# EAGLE design Dual Motor Module (EAGLE 6.3)
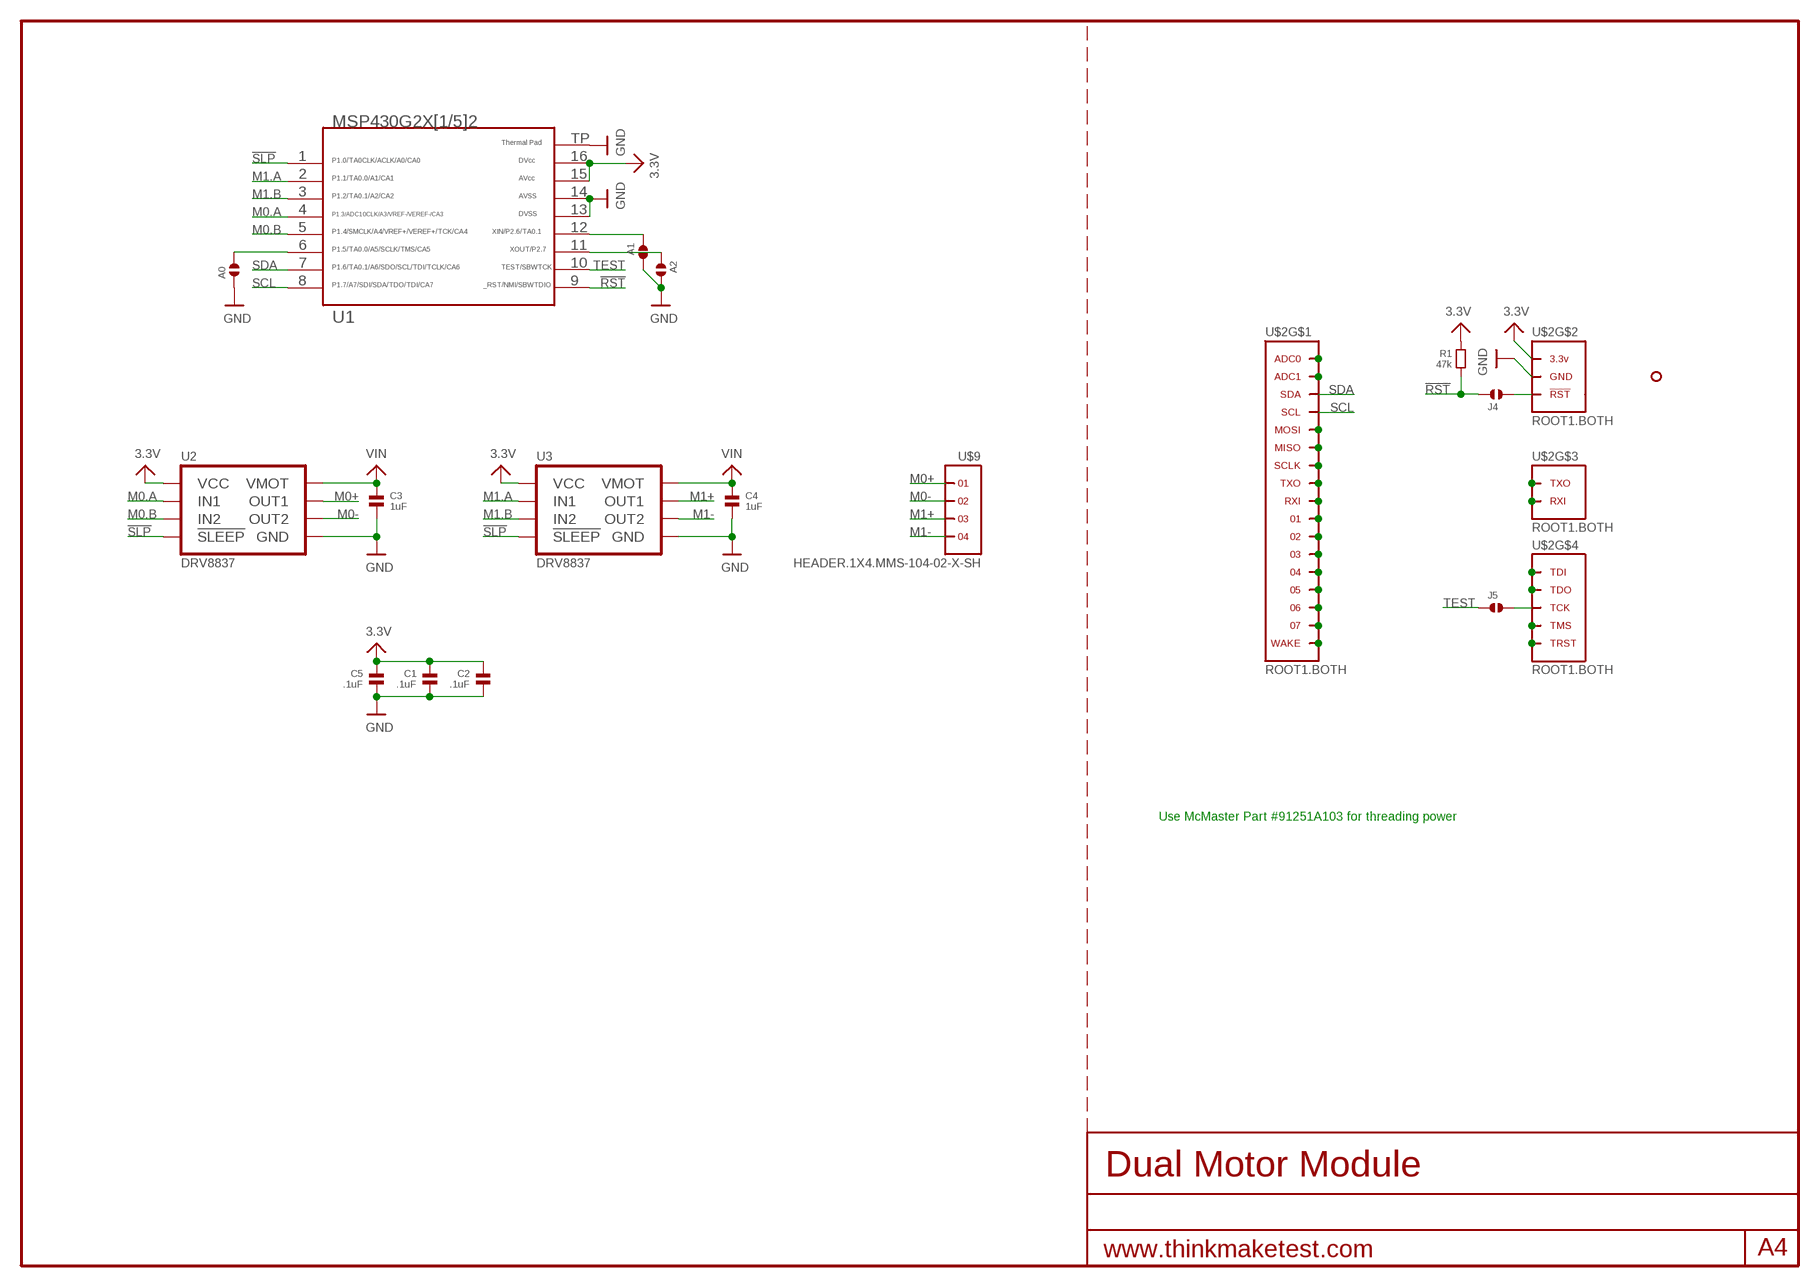
[diagram p0: schematic, sheet 1]

## Parts
A0  SOLDERJUMPER.2.MED  [2.MED]
A1  SOLDERJUMPER.2.MED  [2.MED]
A2  SOLDERJUMPER.2.MED  [2.MED]
C1  .1uF  CAPACITOR.0603  [0603]
C2  .1uF  CAPACITOR.0603  [0603]
C3  1uF  CAPACITOR.0603  [0603]
C4  1uF  CAPACITOR.0603  [0603]
C5  .1uF  CAPACITOR.0603  [0603]
J4  SOLDERJUMPER.2.MED  [2.MED]
J5  SOLDERJUMPER.2.MED  [2.MED]
R1  47k  RESISTOR.0603  [0603]
U1  MSP430G2452.QFN16  G2X[1/5]2---RSA16  [RSA16]
U2  DRV8837  [DSG]
U3  DRV8837  [DSG]
U$2  ROOT1.BOTH  [ROOT1.BOTH]
U$4  HOLE.#2  [#2]
U$9  HEADER.1X4.MMS-104-02-X-SH  [MMS-104-02-X-SH]

## Nets
3.3V: C1.1 C2.1 C5.1 R1.1 U1.15 U1.16 U2.8(VCC) U3.8(VCC) U$2.3.3V@1(3.3V) U$2.3.3V@2(3.3V) U$2.3.3V@3(3.3V) U$2.3.3V@4(3.3V) U$2.3.3V@5(3.3V) U$2.3.3V@6(3.3V) U$2.3.3V@7(3.3V) U$2.3.3V@8(3.3V) U$2.3.3V@9(3.3V) U$2.3.3V@10(3.3V) U$2.3.3V@11(3.3V) U$2.3.3V@12(3.3V) U$2.3.3V@13(3.3V) U$2.3.3V@14(3.3V) U$2.3.3V@15(3.3V) U$2.3.3V@16(3.3V) U$2.3.3V@17(3.3V) U$2.3.3V@18(3.3V) U$2.3.3V@19(3.3V) U$2.3.3V@20(3.3V) U$2.3.3V@21(3.3V) U$2.3.3V@22(3.3V) U$2.3.3V@23(3.3V) U$2.3.3V@24(3.3V) U$2.3.3V@VIA(3.3V)
!RST: J4.1 R1.2 U1.9
!SLP: U1.1 U2.7(!SLEEP) U3.7(!SLEEP)
GND: A0.1 A1.2 A2.2 C1.2 C2.2 C3.2 C4.2 C5.2 U1.13 U1.14 U1.TP U2.4(GND) U2.PAD(GND) U3.4(GND) U3.PAD(GND) U$2.GND@1(GND) U$2.GND@2(GND) U$2.GND@3(GND) U$2.GND@4(GND) U$2.GND@5(GND) U$2.GND@6(GND) U$2.GND@7(GND) U$2.GND@8(GND) U$2.GND@9(GND) U$2.GND@10(GND) U$2.GND@11(GND) U$2.GND@12(GND) U$2.GND@13(GND) U$2.GND@14(GND) U$2.GND@15(GND) U$2.GND@16(GND) U$2.GND@17(GND) U$2.GND@18(GND) U$2.GND@19(GND) U$2.GND@20(GND) U$2.GND@21(GND) U$2.GND@22(GND) U$2.GND@23(GND) U$2.GND@24(GND) U$2.GND@25(GND) U$2.GND@26(GND) U$2.GND@VIA(GND)
M0+: U2.2(OUT1) U$9.1 U$9.1@1
M0-: U2.3(OUT2) U$9.2 U$9.2@1
M0.A: U1.4 U2.6(IN1)
M0.B: U1.5 U2.5(IN2)
M1+: U3.2(OUT1) U$9.3 U$9.3@1
M1-: U3.3(OUT2) U$9.4 U$9.4@1
M1.A: U1.2 U3.6(IN1)
M1.B: U1.3 U3.5(IN2)
N$1: U$2.04 U$2.04@1 U$2.04@VIA
N$2: U$2.ADC1 U$2.ADC1@1(ADC1) U$2.ADC1@VIA(ADC1)
N$3: A0.2 U1.6
N$4: A2.1 U1.11
N$5: U$2.03 U$2.03@1 U$2.03@VIA
N$6: U$2.MISO U$2.MISO@1(MISO) U$2.MISO@VIA(MISO)
N$7: U$2.SCLK U$2.SCLK@1(SCLK) U$2.SCLK@VIA(SCLK)
N$8: U$2.TXO U$2.TXO@1(TXO) U$2.TXO@VIA(TXO)
N$9: U$2.RXI U$2.RXI@1(RXI) U$2.RXI@VIA(RXI)
N$10: U$2.01 U$2.01@1 U$2.01@VIA
N$11: U$2.02 U$2.02@1 U$2.02@VIA
N$12: U$2.MOSI U$2.MOSI@1(MOSI) U$2.MOSI@VIA(MOSI)
N$13: U$2.ADC0 U$2.ADC0@1(ADC0) U$2.ADC0@VIA(ADC0)
N$14: U$2.05 U$2.05@1 U$2.05@VIA
N$15: U$2.06 U$2.06@1 U$2.06@VIA
N$16: U$2.07 U$2.07@1 U$2.07@VIA
N$17: U$2.WAKE U$2.WAKE@1(WAKE) U$2.WAKE@VIA(WAKE)
N$18: U$2.TDI U$2.TDI@1(TDI) U$2.TDI@VIA(TDI)
N$19: U$2.TDO U$2.TDO@1(TDO) U$2.TDO@VIA(TDO)
N$20: J5.2 U$2.TCK U$2.TCK@1(TCK) U$2.TCK@VIA(TCK)
N$21: U$2.TMS U$2.TMS@1(TMS) U$2.TMS@VIA(TMS)
N$22: U$2.TRST U$2.TRST@1(TRST) U$2.TRST@VIA(TRST)
N$23: U$2.RXI.DBG(RXI) U$2.RXI.DBG@1(RXI) U$2.RXI.DBG@VIA(RXI)
N$24: U$2.TXO.DBG(TXO) U$2.TXO.DBG@1(TXO) U$2.TXO.DBG@VIA(TXO)
N$25: J4.2 U$2.RST(!RST) U$2.RST@1(!RST) U$2.RST@VIA(!RST)
N$26: A1.1 U1.12
SCL: U1.8 U$2.SCL U$2.SCL@1(SCL) U$2.SCL@VIA(SCL)
SDA: U1.7 U$2.SDA U$2.SDA@1(SDA) U$2.SDA@VIA(SDA)
TEST: J5.1 U1.10
VIN: C3.1 C4.1 U2.1(VMOT) U3.1(VMOT)

## Notes on the sheet
- Use McMaster Part #91251A103 for threading power

## Library data of the parts
A0 A1 A2 J4 J5 = .solderjumper:SOLDERJUMPER.2
C1-C5 = .standardparts:CAPACITOR
R1 = .standardparts:RESISTOR
U1 = TI_MSP430_v16:G2X[1/5]2---RSA16: MSP430G2X[1/5]2 MSP430G2x52, MSP430G2x12 QFN (RSA) 16 Pin Package http://focus.ti.com/docs/prod/folders/print/msp430g2452.html
U2 U3 = .packages(ti):DRV8837
U$2 = thinkmaketest:ROOT1
U$4 = .screw_holes:HOLE
U$9 = samtec:HEADER.1X4

## Board
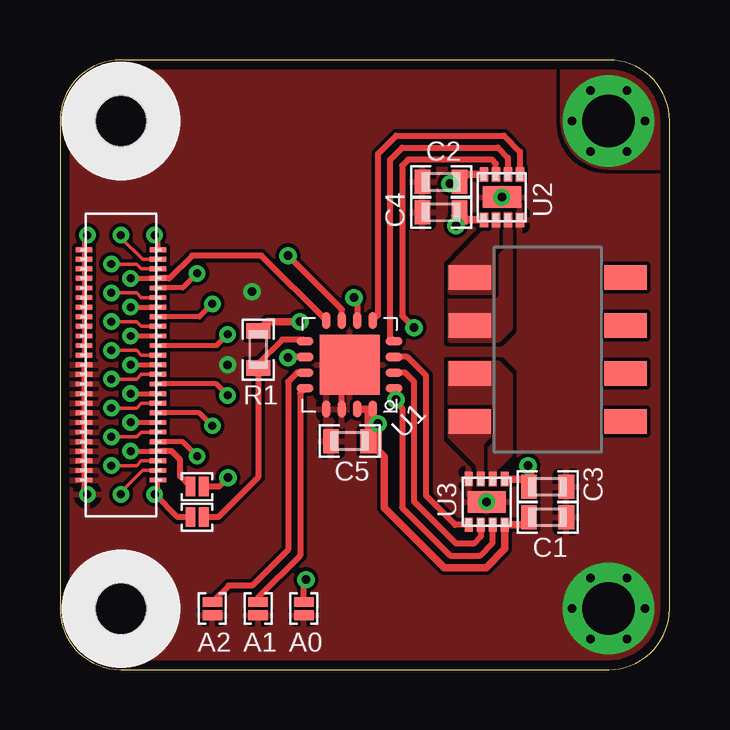
[diagram p1: board, top side]
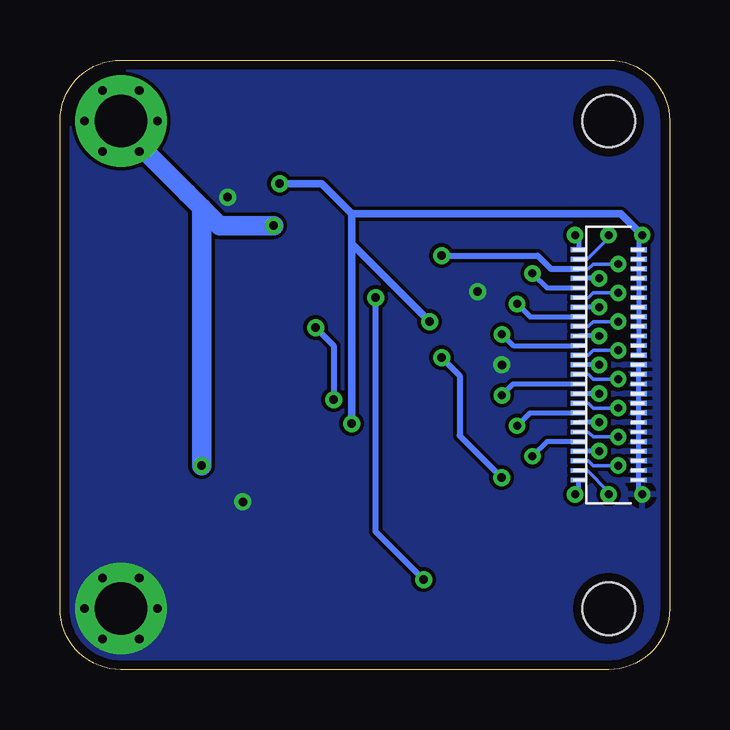
[diagram p2: board, bottom side, seen from below]

Size 25.4 x 25.4 mm. Coordinates in mm from the lower left corner, seen from the top.
Outline: 0,22.86 0,2.54 arc90 2.54,0 22.86,0 arc90 25.4,2.54 25.4,22.86 arc90 22.86,25.4 2.54,25.4 arc90 0,22.86
Copper layers (1*16): Top 0.0356mm / dielectric 1.5011mm / Bottom 0.0356mm
Design rules "default": minimum track width 6mil, minimum drill 13mil, track to track 6mil, track to pad 6mil, pad to pad 6mil, via to via 6mil, smd to smd 6mil, copper to edge 15mil, drill to drill 6mil, minimum pad ring 7mil, minimum via ring 7mil, stop-mask expansion 4mil, vias tented up to drill 16mil, thermal gap 10mil

### Footprints (pad centres in the part's own frame; a part is rotated, then mirrored left to right if it is on the bottom)
2.MED = smd 0.406 x 0.813: 1 -0.279,0; 2 0.279,0
0603 = smd 0.65 x 1: 1 -0.775,0; 2 0.775,0
RSA16 = smd 0.7 x 0.35: 1 -1.85,0.975; 2 -1.85,0.325; 3 -1.85,-0.325; 4 -1.85,-0.975; 9 1.85,-0.975; 10 1.85,-0.325; 11 1.85,0.325; 12 1.85,0.975 | smd 0.35 x 0.7: 5 -0.975,-1.85; 6 -0.325,-1.85; 7 0.325,-1.85; 8 0.975,-1.85; 13 0.975,1.85; 14 0.325,1.85; 15 -0.325,1.85; 16 -0.975,1.85 | smd 2.5 x 2.5: TP 0,0
DSG = smd 0.6 x 0.35: 1 -0.95,0.75; 2 -0.95,0.25; 3 -0.95,-0.25; 4 -0.95,-0.75; 5 0.95,-0.75; 6 0.95,-0.25; 7 0.95,0.25; 8 0.95,0.75 | smd 0.9 x 1.6: PAD 0,0
ROOT1.BOTH = smd 0.66 x 0.2 bottom: 01 3.795,13.9; 02 3.795,13.5; 03 3.795,13.1; 3.3V@1 1.285,17.5; 3.3V@2 1.285,17.1; 3.3V@3 1.285,16.7; 3.3V@4 1.285,16.3; 3.3V@5 1.285,15.9; 3.3V@6 1.285,15.5; 3.3V@7 1.285,15.1; 3.3V@8 1.285,14.7; 3.3V@9 1.285,14.3; 3.3V@10 1.285,13.9; 3.3V@11 1.285,13.5; 3.3V@12 1.285,13.1; 04 3.795,12.7; 05 3.795,12.3; 06 3.795,11.9; 07 3.795,11.5; ADC0 3.795,17.5; ADC1 3.795,17.1; GND@1 1.285,7.9; GND@2 1.285,8.3; GND@3 1.285,8.7; GND@4 1.285,9.1; GND@5 1.285,9.5; GND@6 1.285,9.9; GND@7 1.285,10.3; GND@8 1.285,10.7; GND@9 1.285,11.1; GND@10 1.285,11.5; GND@11 1.285,11.9; GND@12 1.285,12.3; GND@13 1.285,12.7; MISO 3.795,15.5; MOSI 3.795,15.9; RST 3.795,7.9; RXI 3.795,14.3; RXI.DBG 3.795,10.3; SCL 3.795,16.3; SCLK 3.795,15.1; SDA 3.795,16.7; TCK 3.795,9.1; TDI 3.795,9.9; TDO 3.795,9.5; TMS 3.795,8.7; TRST 3.795,8.3; TXO 3.795,14.7; TXO.DBG 3.795,10.7; WAKE 3.795,11.1 | smd 0.7 x 0.2: 01@1 4.08,13.9; 02@1 4.08,13.5; 3.3V@13 1,17.5; 3.3V@14 1,17.1; 3.3V@15 1,16.7; 3.3V@16 1,16.3; 3.3V@17 1,15.9; 3.3V@18 1,15.5; 3.3V@19 1,15.1; 3.3V@20 1,14.7; 3.3V@21 1,14.3; 3.3V@22 1,13.9; 3.3V@23 1,13.5; 3.3V@24 1,13.1; 03@1 4.08,13.1; 04@1 4.08,12.7; 05@1 4.08,12.3; 06@1 4.08,11.9; 07@1 4.08,11.5; ADC0@1 4.08,17.5; ADC1@1 4.08,17.1; GND@14 1,7.9; GND@15 1,8.3; GND@16 1,8.7; GND@17 1,9.1; GND@18 1,9.5; GND@19 1,9.9; GND@20 1,10.3; GND@21 1,10.7; GND@22 1,11.1; GND@23 1,11.5; GND@24 1,11.9; GND@25 1,12.3; GND@26 1,12.7; MISO@1 4.08,15.5; MOSI@1 4.08,15.9; RST@1 4.08,7.9; RXI.DBG@1 4.08,10.3; RXI@1 4.08,14.3; SCL@1 4.08,16.3; SCLK@1 4.08,15.1; SDA@1 4.08,16.7; TCK@1 4.08,9.1; TDI@1 4.08,9.9; TDO@1 4.08,9.5; TMS@1 4.08,8.7; TRST@1 4.08,8.3; TXO.DBG@1 4.08,10.7; TXO@1 4.08,14.7; WAKE@1 4.08,11.1 | drill 0.33 pad 0.686: 01@VIA 2.94,13.9; 02@VIA 6.985,13.97; 3.3V@VIA 1.14,18.1; 03@VIA 2.14,13.3; 04@VIA 2.94,12.7; 05@VIA 2.14,12.1; 06@VIA 6.985,11.43; 07@VIA 2.94,11.5; ADC0@VIA 3.94,18.1; ADC1@VIA 2.54,18.1; GND@VIA 1.14,7.3; MISO@VIA 2.14,15.7; MOSI@VIA 5.715,16.51; RST@VIA 3.94,7.3; RXI.DBG@VIA 2.94,10.3; RXI@VIA 2.14,14.5; SCL@VIA 2.94,16.3; SCLK@VIA 2.94,15.1; SDA@VIA 2.14,16.9; TCK@VIA 2.94,9.1; TDI@VIA 2.14,9.7; TDO@VIA 5.715,8.89; TMS@VIA 2.14,8.5; TRST@VIA 2.54,7.3; TXO.DBG@VIA 6.35,10.16; TXO@VIA 6.35,15.24; WAKE@VIA 2.14,10.9
#2 = hole 2.184: 0,0
MMS-104-02-X-SH = smd 1.02 x 1.78: 1 -3,-3.24; 1@1 -3,3.24; 2 -1,-3.24; 2@1 -1,3.24; 3 1,-3.24; 3@1 1,3.24; 4 3,-3.24; 4@1 3,3.24

### Placement (x,y rotation side)
A0  10.16,2.54 90 top
A1  8.26,2.54 270 top
A2  6.35,2.54 270 top
C1  20.32,6.35 0 top
C2  15.88,20.32 180 top
C3  20.32,7.62 0 top
C4  15.88,19.05 180 top
C5  12.06,9.53 180 top
J4  5.71,6.35 180 top
J5  5.71,7.62 180 top
R1  8.26,13.34 270 top
U1  12.06,12.7 180 top
U2  18.41,19.68 90 top
U3  17.78,6.99 270 top
U$2  0,0 0 top
U$3  HOLE.#2  [#2]  2.54,2.54 90 top
U$4  2.54,22.86 90 top
U$9  20.32,13.34 270 top

### Tracks (layer width: path | path; a pad name or v marks a point on that pad's centre or on a via)
3.3V  (via drill 0.36)
  Top 0.305: C1.1 19.23,6.04 U3.8 18.53,5.03 17.75,4.25 16,4.25 13.5,6.75 13.5,8.87 13.25,9.12 | U1.15 U1.16 12.84,10.65 C5.1 13.25,9.12 | C2.1 16.96,20.64 U2.8 16.64,20.64 v16.25,20.25 | 13.25,9.12 v13.25,10.25 | 8.26,14.26 R1.1 8.64,14.5 v10,14.5
  Bottom 0.305: v13.25,10.25 13.25,17.75 | 13.25,19 2.04,19 U$2.3.3V@VIA | v10,14.5 13.25,17.75 | 13.25,17.75 13.25,19 | v16.25,20.25 14.5,20.25 13.25,19
!RST
  Top 0.254: U1.9 10.14,13.75 9.25,13.75 8.26,12.76 R1.2 8.26,8.01 6.6,6.35 J4.1
!SLP  (via drill 0.36)
  Top 0.254: U3.7 18.03,5.28 17.5,4.75 16.25,4.75 14.25,6.75 14.25,10.89 14,11.14 v14,11.25 14,11.64 U1.1 | U2.7 18.16,21.09 18,21.25 14.5,21.25 14.25,21 14.25,14.75 v14.75,14.25
  Bottom 0.254: v14.75,14.25 14,13.5 v14,11.25
GND  (via drill 0.36, 2.18 pad 3.81)
  Top 0.254: U1.14 11.74,12.38 U1.TP
  other vias: 22.86,2.54 18.41,19.68 17.78,6.99 6.99,12.7 8,15.75 21.34,2.54 24.38,2.54 22.1,3.81 23.62,3.81 23.62,1.27 22.1,1.27
  pour Bottom (rank 6): 0,0 25.4,0 25.4,25.4 0,25.4
  pour Top (rank 6): 0,0 25.4,0 25.4,25.4 0,25.4
M0+
  pour Top (no thermals): 18.1,18.65 16.25,16.75 16.25,15.75 18,15.75 18,17.5 18.2,17.7 18.2,19 18.1,19
M0-
  pour Top (rank 2, no thermals): 18.5,19 18.5,17.75 18.25,17.5 18.25,15.5 16.25,15.5 16.25,13.75 18.25,13.75 18.75,14.25 18.75,19
M0.A
  Top 0.254: U1.4 13.75,13.84 13.75,21.25 14.25,21.75 18.25,21.75 18.66,21.34 U2.6
M0.B
  Top 0.254: U1.5 13.25,14.76 13.25,21.5 14,22.25 18.5,22.25 19.16,21.59 U2.5
M1+
  pour Top (rank 2, no thermals): 16.25,12.75 16.25,11 18,11 18,9.5 17.75,9.25 17.75,7.75 18.25,7.75 18.25,8.5 18.75,9 18.75,12.25 18.25,12.75
M1-
  pour Top (no thermals): 16.25,10.75 16.25,9.75 17.45,8.55 17.45,7.75 17.55,7.75 17.55,9.45 17.85,9.75 17.85,10.75
M1.A
  Top 0.254: U3.6 17.53,5.53 17.25,5.25 16.5,5.25 14.75,7 14.75,12 14.38,12.38 U1.2
M1.B
  Top 0.254: U3.5 16.46,6.04 15.25,7.25 15.25,12.25 14.47,13.03 U1.3
N$3  (via drill 0.36)
  Top 0.254: A0.2 10.16,3.66 v10.25,3.75 | v12.25,15.5 12.39,15.36 U1.6
  Bottom 0.254: v10.25,3.75 12.25,5.75 v12.25,15.5
N$4
  Top 0.254: U1.11 9.88,12.38 9.5,12 9.5,5 8,3.5 7.03,3.5 A2.1
N$20
  Top 0.254: J5.2 5,8.06 5,8.75 4.65,9.1 U$2.TCK@1
N$25
  Top 0.254: J4.2 4.89,6.35 U$2.RST@VIA
N$26
  Top 0.254: U1.12 10,11.51 10,4.75 8.26,3 A1.1
SCL
  Top 0.254: U1.8 8.39,17.25 5.5,17.25 4.55,16.3 U$2.SCL@1
SDA  (via drill 0.36)
  Top 0.254: U1.7 11.74,15.01 v9.5,17.25
  Bottom 0.254: v9.5,17.25 5.5,17.25 4.95,16.7 U$2.SDA
TEST  (via drill 0.36)
  Top 0.254: U1.10 9.53,13.03 v9.5,13 | v7,8 6.62,7.62 J5.1
  Bottom 0.254: v9.5,13 8.75,12.25 8.75,9.75 v7,8
VIN  (via drill 0.36, 2.18 pad 3.81)
  Top 0.305: U3.1 19.23,7.93 C3.1 | C4.1 16.96,18.73 U2.1
  Top 0.406: C4.1 16.5,18.9 v16.5,18.5 | v19.5,8.5 19.55,8.46 C3.1
  Bottom 0.813: v22.86,22.86 22.86,22.61 20.12,19.88 19.5,19.25 | 19.5,19.25 18.75,18.5 v16.5,18.5 | v19.5,8.5 19.5,19.25
  other vias: 24.38,22.86 21.34,22.86 22.1,24.13 23.62,24.13 23.62,21.59 22.1,21.59
  pour Top: 20.95,25.4 20.95,22.86 arc90 22.86,20.95 25.4,20.95 25.4,22.86 arc90 22.86,25.4

### Text on the board
bDocu: v1 | Cruz Monrreal II | AnomalousMaker.com